# Altium schematic sheet etapa3_anger_Y.SchDoc
size A4
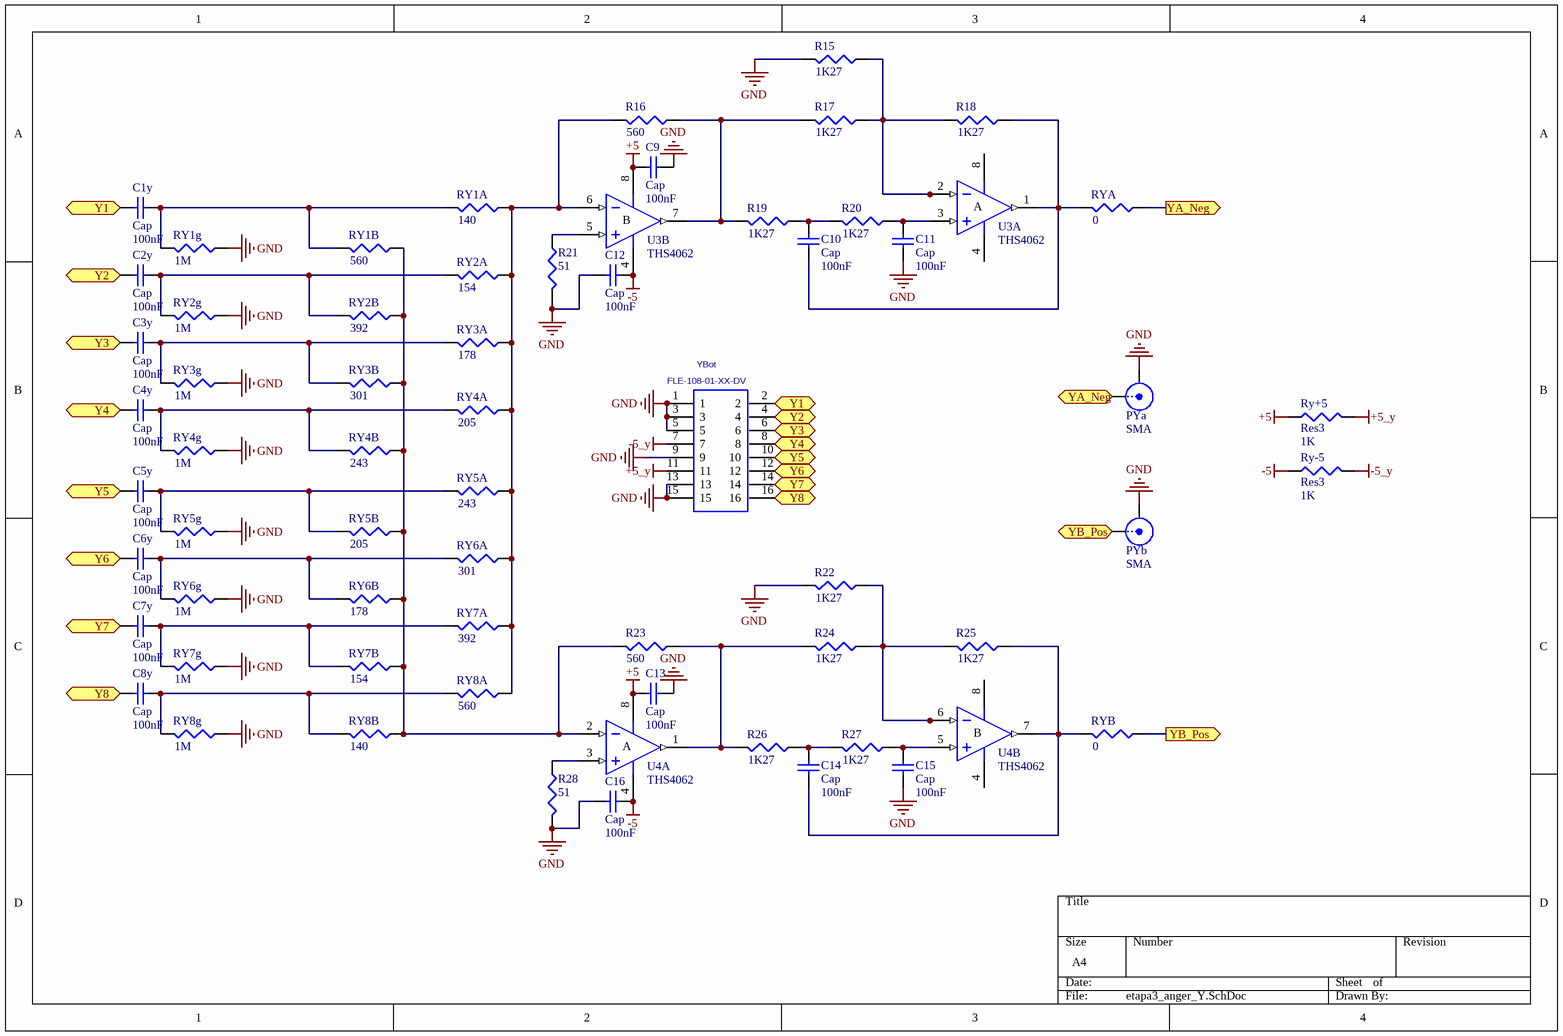
[diagram p0: etapa3_anger_Y.SchDoc]

## Parts
C1y  Cap  value 100nF  [0402]
C2y  Cap  value 100nF  [0402]
C3y  Cap  value 100nF  [0402]
C4y  Cap  value 100nF  [0402]
C5y  Cap  value 100nF  [0402]
C6y  Cap  value 100nF  [0402]
C7y  Cap  value 100nF  [0402]
C8y  Cap  value 100nF  [0402]
C9  Cap  value 100nF  [0402]
C10  Cap  value 100nF  [0402]
C11  Cap  value 100nF  [0402]
C12  Cap  value 100nF  [0402]
C13  Cap  value 100nF  [0402]
C14  Cap  value 100nF  [0402]
C15  Cap  value 100nF  [0402]
C16  Cap  value 100nF  [0402]
PYa  SMA  [SMB_V-RJ45]
PYb  SMA  [SMB_V-RJ45]
R15  value 1K27  [0402]  (hidden comment: Res3)
R16  value 560  [0402]  (hidden comment: Res3)
R17  value 1K27  [0402]  (hidden comment: Res3)
R18  value 1K27  [0402]  (hidden comment: Res3)
R19  value 1K27  [0402]  (hidden comment: Res3)
R20  value 1K27  [0402]  (hidden comment: Res3)
R21  value 51  [0402]  (hidden comment: Res3)
R22  value 1K27  [0402]  (hidden comment: Res3)
R23  value 560  [0402]  (hidden comment: Res3)
R24  value 1K27  [0402]  (hidden comment: Res3)
R25  value 1K27  [0402]  (hidden comment: Res3)
R26  value 1K27  [0402]  (hidden comment: Res3)
R27  value 1K27  [0402]  (hidden comment: Res3)
R28  value 51  [0402]  (hidden comment: Res3)
RY1A  value 140  [0402]  (hidden comment: Res3)
RY1B  value 560  [0402]  (hidden comment: Res3)
RY1g  value 1M  [0402]  (hidden comment: Res3)
RY2A  value 154  [0402]  (hidden comment: Res3)
RY2B  value 392  [0402]  (hidden comment: Res3)
RY2g  value 1M  [0402]  (hidden comment: Res3)
RY3A  value 178  [0402]  (hidden comment: Res3)
RY3B  value 301  [0402]  (hidden comment: Res3)
RY3g  value 1M  [0402]  (hidden comment: Res3)
RY4A  value 205  [0402]  (hidden comment: Res3)
RY4B  value 243  [0402]  (hidden comment: Res3)
RY4g  value 1M  [0402]  (hidden comment: Res3)
RY5A  value 243  [0402]  (hidden comment: Res3)
RY5B  value 205  [0402]  (hidden comment: Res3)
RY5g  value 1M  [0402]  (hidden comment: Res3)
RY6A  value 301  [0402]  (hidden comment: Res3)
RY6B  value 178  [0402]  (hidden comment: Res3)
RY6g  value 1M  [0402]  (hidden comment: Res3)
RY7A  value 392  [0402]  (hidden comment: Res3)
RY7B  value 154  [0402]  (hidden comment: Res3)
RY7g  value 1M  [0402]  (hidden comment: Res3)
RY8A  value 560  [0402]  (hidden comment: Res3)
RY8B  value 140  [0402]  (hidden comment: Res3)
RY8g  value 1M  [0402]  (hidden comment: Res3)
Ry+5  Res3  value 1K  [J1-0603]
Ry-5  Res3  value 1K  [J1-0603]
RYA  value 0  [0402]  (hidden comment: Res3)
RYB  value 0  [0402]  (hidden comment: Res3)
U3  THS4062  [SO-8_M]  (parts A,B of 2)
U4  THS4062  [SO-8_M]  (parts A,B of 2)
YBot  FLE-108-01-XX-DV  [FLE-108-01-XX-DV]

## Ports
Y1 (out), Y2 (out), Y3 (out), Y4 (out), Y5 (out), Y6 (out), Y7 (out), Y8 (out), YA_Neg (out), YB_Pos (out)

## Nets
+5: C9.1 C13.1 Ry+5.1 U3.8(V+) U4.8(V+)
+5_y: Ry+5.2 YBot.11
-5: C12.2 C16.2 Ry-5.1 U3.4(V-) U4.4(V-)
-5_y: Ry-5.2 YBot.7
GND: C9.2 C11.2 C12.1 C13.2 C15.2 C16.1 PYa.2(Y) PYb.2(Y) R15.2 R21.2 R22.2 R28.2 RY1g.1 RY2g.1 RY3g.1 RY4g.1 RY5g.1 RY6g.1 RY7g.1 RY8g.1 YBot.1 YBot.3 YBot.5 YBot.9 YBot.13 YBot.15
Y1: C1y.1 YBot.2 ; port Y1
Y2: C2y.1 YBot.4 ; port Y2
Y3: C3y.1 YBot.6 ; port Y3
Y4: C4y.1 YBot.8 ; port Y4
Y5: C5y.1 YBot.10 ; port Y5
Y6: C6y.1 YBot.12 ; port Y6
Y7: C7y.1 YBot.14 ; port Y7
Y8: C8y.1 YBot.16 ; port Y8
YA_Neg: PYa.1(X) RYA.1 ; port YA_Neg
YB_Pos: PYb.1(X) RYB.1 ; port YB_Pos
NetC1y_2: C1y.2 RY1A.2 RY1B.2 RY1g.2
NetC2y_2: C2y.2 RY2A.2 RY2B.2 RY2g.2
NetC3y_2: C3y.2 RY3A.2 RY3B.2 RY3g.2
NetC4y_2: C4y.2 RY4A.2 RY4B.2 RY4g.2
NetC5y_2: C5y.2 RY5A.2 RY5B.2 RY5g.2
NetC6y_2: C6y.2 RY6A.2 RY6B.2 RY6g.2
NetC7y_2: C7y.2 RY7A.2 RY7B.2 RY7g.2
NetC8y_2: C8y.2 RY8A.2 RY8B.2 RY8g.2
NetC10_1: C10.1 R19.1 R20.2
NetC10_2: C10.2 R18.1 RYA.2 U3.1(OUT)
NetC11_1: C11.1 R20.1 U3.3(IN+)
NetC14_1: C14.1 R26.1 R27.2
NetC14_2: C14.2 R25.1 RYB.2 U4.7(OUT)
NetC15_1: C15.1 R27.1 U4.5(IN+)
NetR15_1: R15.1 R17.1 R18.2 U3.2(IN-)
NetR16_1: R16.1 R17.2 R19.2 U3.7(OUT)
NetR16_2: R16.2 RY1A.1 RY2A.1 RY3A.1 RY4A.1 RY5A.1 RY6A.1 RY7A.1 RY8A.1 U3.6(IN-)
NetR21_1: R21.1 U3.5(IN+)
NetR22_1: R22.1 R24.1 R25.2 U4.6(IN-)
NetR23_1: R23.1 R24.2 R26.2 U4.1(OUT)
NetR23_2: R23.2 RY1B.1 RY2B.1 RY3B.1 RY4B.1 RY5B.1 RY6B.1 RY7B.1 RY8B.1 U4.2(IN-)
NetR28_1: R28.1 U4.3(IN+)

## Notes on the sheet
- (in symbol AD8002AR, part A) A
- (in symbol AD8002AR, part B) B

## Library data of the parts
C1y C2y C3y C4y C5y C6y C7y C8y C9-C16 = Cap: Capacitor; Published: 8-Jun-2000; LatestRevisionDate: 17-Jul-2002; LatestRevisionNote: Re-released for DXP Platform.; PackageReference: RAD-0.3; Publisher: Altium Limited; PackageDescription: Radial Cap, Thru-Hole; 2 Leads; 0.3 in Pin Spacing
PYa PYb = SMB: SMB Straight Connector; LatestRevisionDate: 17-Jul-2002; LatestRevisionNote: Re-released for DXP Platform.; Publisher: Altium Limited
R15-R28 RY1A RY1B RY1g RY2A RY2B RY2g RY3A RY3B RY3g RY4A RY4B RY4g RY5A RY5B RY5g RY6A RY6B RY6g RY7A RY7B RY7g RY8A RY8B RY8g Ry+5 Ry-5 RYA RYB = Res3: Resistor; Published: 8-Jun-2000; LatestRevisionDate: 29-May-2009; LatestRevisionNote: IPC-7351 Footprint Added.; PackageReference: J1-0603; Publisher: Altium Limited; PackageDescription: Chip Resistor
U3 U4 = AD8002AR: Dual 600MHz, 50mW Current Feedback Amplifier; Published: 8-Jun-2000; LatestRevisionDate: 13-Apr-2006; LatestRevisionNote: IPC-7351 Footprint Added.; DatasheetVersion: REV. C 1999; PackageVersion: revA; PackageReference: SO-8; Publisher: Altium Limited; PackageDescription: 8-Pin Small Outline Integrated Circuit 1.27 mm Pitch; Code_JEDEC: MS-012-AA; Code_IPC: SOIC127P600-8; ComponentLink1Description: Manufacturer Link; ComponentLink1URL: http://www.analog.com/en/prod/0,,759_786_AD8002%2C00.html; ComponentLink2Description: Datasheet; ComponentLink2URL: http://www.analog.com/UploadedFiles/Data_Sheets/147523773AD8002_d.pdf
YBot = FLE-108-01-XX-DV: DUAL ROW 0.050'' STRIP ASSEMBLY.; MANUFACTURER: SAMTEC; CREATED: December 2, 2014 - Wendy Xin; PCB DECAL: FLE-108-01-XX-DV